# Altium schematic sheet other.SchDoc: X
size A4; Date: DD-MM-YYYY; CheckedBy: X; DrawnBy: Y; Revision: 0.0.0; SheetNumber: X; SheetTotal: Y; Projectnumber: OWN-000; Size: A4; Projectname: X
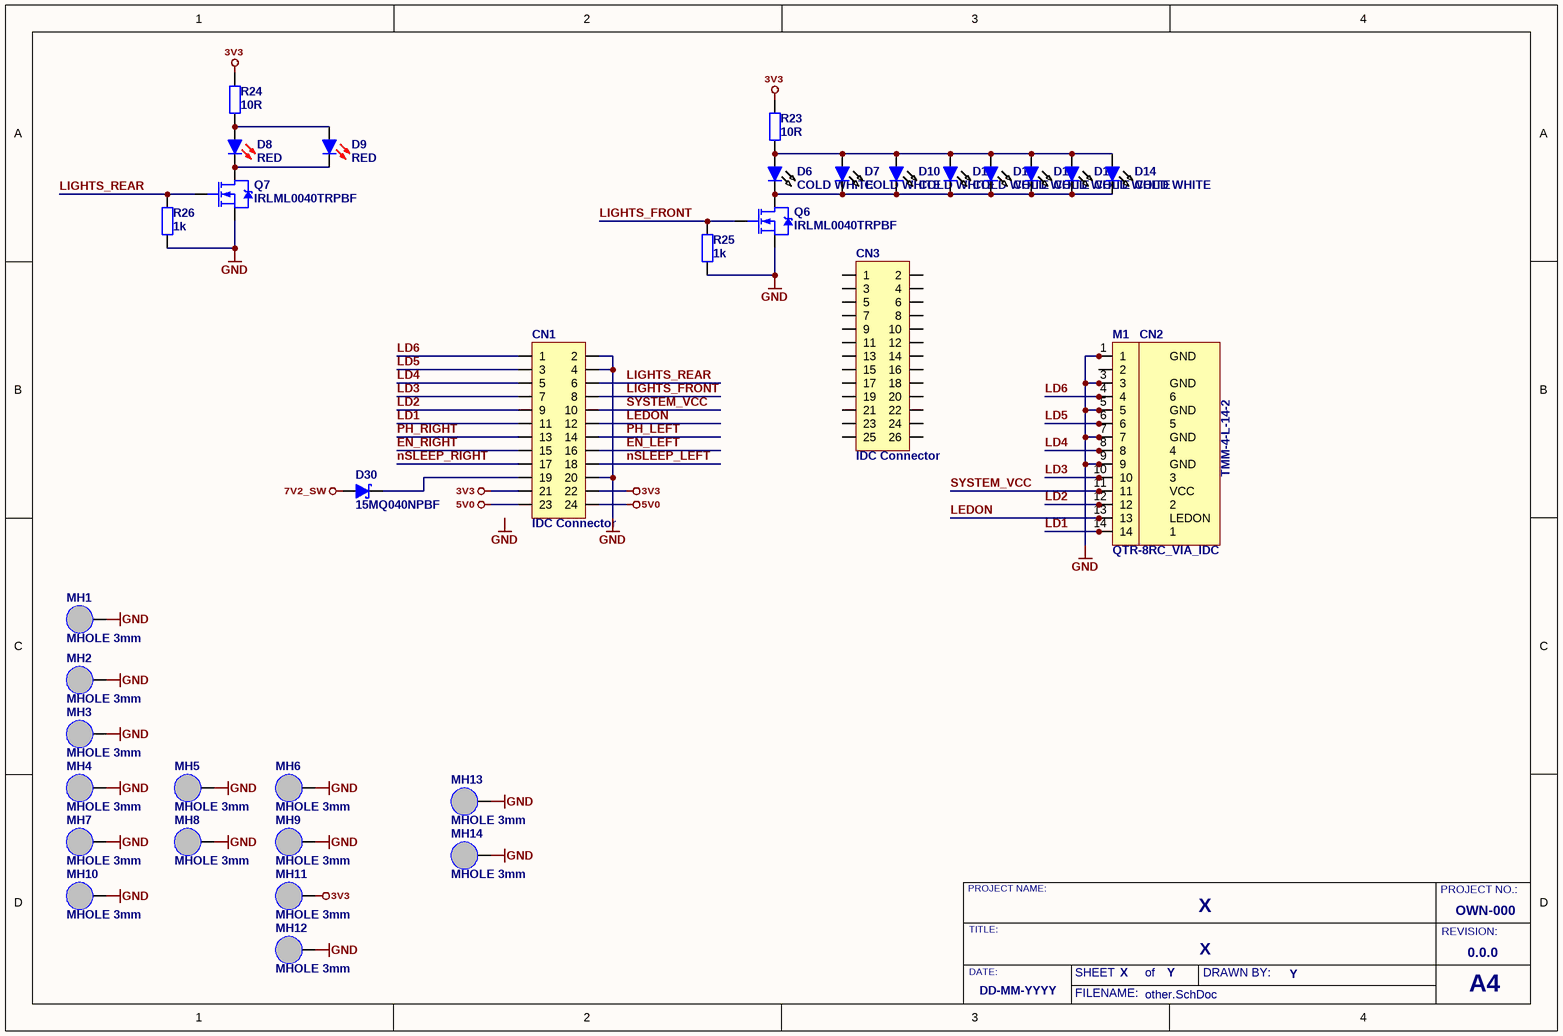
[diagram p0: other.SchDoc]

## Parts
CN1  IDC Connector  [IDC24_RA _W_CN]
CN2  TMM-4-L-14-2  [MM_14_LCK_W_CN]
CN3  IDC Connector  [IDC26_RA]
D6  COLD WHITE  [LTW-108DCG-HS10]
D7  COLD WHITE  [LTW-108DCG-HS10]
D8  RED  [FIX-LED1L-2.5]
D9  RED  [FIX-LED1L-2.5]
D10  COLD WHITE  [LTW-108DCG-HS10]
D11  COLD WHITE  [LTW-108DCG-HS10]
D12  COLD WHITE  [LTW-108DCG-HS10]
D13  COLD WHITE  [LTW-108DCG-HS10]
D14  COLD WHITE  [LTW-108DCG-HS10]
D15  COLD WHITE  [LTW-108DCG-HS10]
D30  15MQ040NPBF  [SMA]
M1  QTR-8RC_VIA_IDC  [QTR-8RC_SNAPPED_IDC_2]
MH1  MHOLE 3mm  [3mm screw drill I]  (no BOM)
MH2  MHOLE 3mm  [3mm screw drill I]  (no BOM)
MH3  MHOLE 3mm  [3mm screw drill I]  (no BOM)
MH4  MHOLE 3mm  [3mm screw drill I]  (no BOM)
MH5  MHOLE 3mm  [3mm screw drill I]  (no BOM)
MH6  MHOLE 3mm  [3mm screw drill I]  (no BOM)
MH7  MHOLE 3mm  [3mm screw drill I]  (no BOM)
MH8  MHOLE 3mm  [3mm screw drill I]  (no BOM)
MH9  MHOLE 3mm  [3mm screw drill I]  (no BOM)
MH10  MHOLE 3mm  [3mm screw drill I]  (no BOM)
MH11  MHOLE 3mm  [3mm screw drill I]  (no BOM)
MH12  MHOLE 3mm  [3mm screw drill I]  (no BOM)
MH13  MHOLE 3mm  [3mm screw drill I]  (no BOM)
MH14  MHOLE 3mm  [3mm screw drill I]  (no BOM)
Q6  IRLML0040TRPBF  [SOT-23]
Q7  IRLML0040TRPBF  [SOT-23]
R23  10R  [R0805]
R24  10R  [R0805]
R25  1k  [R0805]
R26  1k  [R0805]

## Nets
3V3: CN1.21 CN1.22 MH11.1(GND) R23.1 R24.1
5V0: CN1.23 CN1.24
7V2_SW: D30.1(A)
GND: CN1.2 CN1.4 CN1.20 CN2.1 CN2.3 CN2.5 CN2.7 CN2.9 M1.1(GND) M1.3(GND) M1.5(GND) M1.7(GND) M1.9(GND) MH1.1(GND) MH2.1(GND) MH3.1(GND) MH4.1(GND) MH5.1(GND) MH6.1(GND) MH7.1(GND) MH8.1(GND) MH9.1(GND) MH10.1(GND) MH12.1(GND) MH13.1(GND) MH14.1(GND) Q6.2(S) Q7.2(S) R25.2 R26.2
EN_LEFT: CN1.16
EN_RIGHT: CN1.15
LD1: CN1.11 CN2.14 M1.14(1)
LD2: CN1.9 CN2.12 M1.12(2)
LD3: CN1.7 CN2.10 M1.10(3)
LD4: CN1.5 CN2.8 M1.8(4)
LD5: CN1.3 CN2.6 M1.6(5)
LD6: CN1.1 CN2.4 M1.4(6)
LEDON: CN1.12 CN2.13 M1.13(LEDON)
LIGHTS_FRONT: CN1.8 Q6.1(G) R25.1
LIGHTS_REAR: CN1.6 Q7.1(G) R26.1
nSLEEP_LEFT: CN1.18
nSLEEP_RIGHT: CN1.17
PH_LEFT: CN1.14
PH_RIGHT: CN1.13
SYSTEM_VCC: CN1.10 CN2.11 M1.11(VCC)
NetCN1_19: CN1.19 D30.2(K)
NetD6_1: D6.1(A) D7.1(A) D10.1(A) D11.1(A) D12.1(A) D13.1(A) D14.1(A) D15.1(A) R23.2
NetD6_2: D6.2(K) D7.2(K) D10.2(K) D11.2(K) D12.2(K) D13.2(K) D14.2(K) D15.2(K) Q6.3(D)
NetD8_1: D8.1(A) D9.1(A) R24.2
NetD8_2: D8.2(K) D9.2(K) Q7.3(D)

Not connected (* = marked no-connect by the designer): CN2 2; CN3 1 2 3 4 5 6 7 8 9 10 11 12 13 14 15 16 17 18 19 20 21 22 23 24 25 26

## Notes on the sheet
- Labels drawn without touching a wire or pin: GND
- PROJECT NAME:
- PROJECT NO.:
- DATE:
- TITLE:
- SHEET
- of
- DRAWN BY:
- REVISION:
- FILENAME:
- A4

## Library data of the parts
CN1 = CN_12x2
CN2 = TMM-4-L-14-2: 14-pin MicroMarch Female Socket With Locking Mechanism, Vertical, THT
CN3 = CN_13x2
D6 D7 D10-D15 = LTW-108DCG-HS10: Published: 04-Apr-2006
D8 D9 = LED_THT_RED: Throughole RED LED; Published: 04-Apr-2006
D30 = 15MQ040NPBF: Schottky barrier rectifier: 40V, 1.5A, SMA; Published: 26-Mar-2006; Supplier 1: Farnell; Supplier 2: Farnell; Supplier 3: Farnell; Supplier 4: Farnell; Supplier 5: Farnell; Supplier 6: Farnell; Supplier 7: Farnell; Supplier 8: Farnell; Supplier Part Number 1: 9101268RL; Supplier Part Number 2: 1463215; Supplier Part Number 3: 1651114RL; Supplier Part Number 4: 1562283; Supplier Part Number 5: 1651114; Supplier Part Number 6: 1463215RL; Supplier Part Number 7: 9101268; Supplier Part Number 8: 2078102
M1 = QTR-8RC_VIA_IDC: QTR-8RC Reflectance Sensor Array (Pololu item No. 961); Published: 14-Sep-2006
MH1-MH14 = MHOLE_3MM: 3mm Mounting Hole
Q6 Q7 = IRLML0040TRPBF: N-Channel; 40V, 3.6A, 1,25W; HEXFET Power MOS-FET; Supplier 1: Farnell; Supplier 2: TME; Supplier 3: Farnell; Supplier 4: Farnell; Supplier Part Number 1: 1831088RL; Supplier Part Number 2: IRLML0040TRPBF; Supplier Part Number 3: 1829136; Supplier Part Number 4: 1831088
R23-R26 = Res: Resistor; Published: 19-Feb-2006; ComponentLink1Description: datasheet; ComponentLink2Description: supplier
  R23 R24: Value: 10R
  R25 R26: Value: 1k